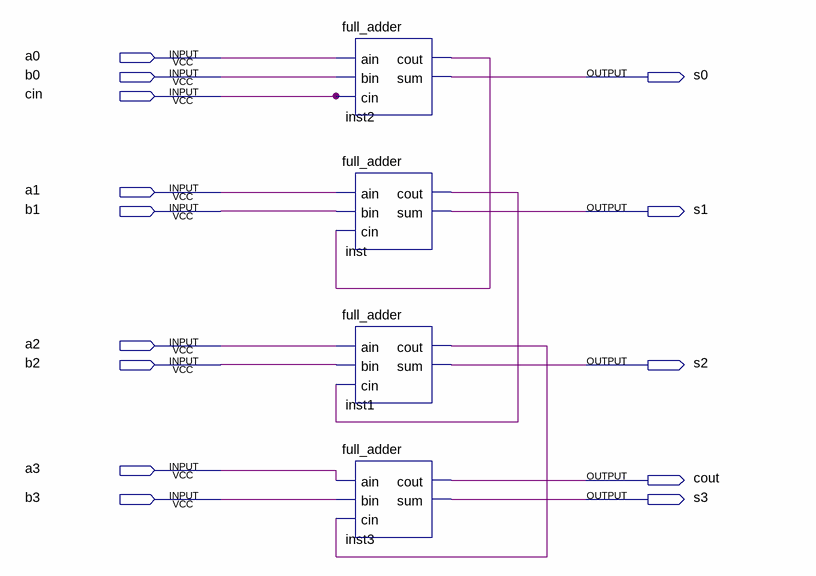
[diagram p0: schematic sheet]
// Quartus schematic adder4.bdf as structural Verilog: 4 symbols, 14 pins
module adder4 (
  input  a0,
  input  b0,
  input  cin,
  input  a1,
  input  b1,
  input  a2,
  input  b2,
  input  a3,
  input  b3,
  output s0,
  output s1,
  output s2,
  output cout,
  output s3
);

  wire inst1_cout, inst2_cout, inst_cout;

  full_adder inst2 (.ain(a0), .bin(b0), .cin(cin), .cout(inst2_cout), .sum(s0));
  full_adder inst (.ain(a1), .bin(b1), .cin(inst2_cout), .cout(inst_cout), .sum(s1));
  full_adder inst1 (.ain(a2), .bin(b2), .cin(inst_cout), .cout(inst1_cout), .sum(s2));
  full_adder inst3 (.ain(a3), .bin(b3), .cin(inst1_cout), .cout(cout), .sum(s3));
endmodule
